# Altium schematic sheet Main.SchDoc
size A4; SheetNumber: 1; SheetTotal: 3
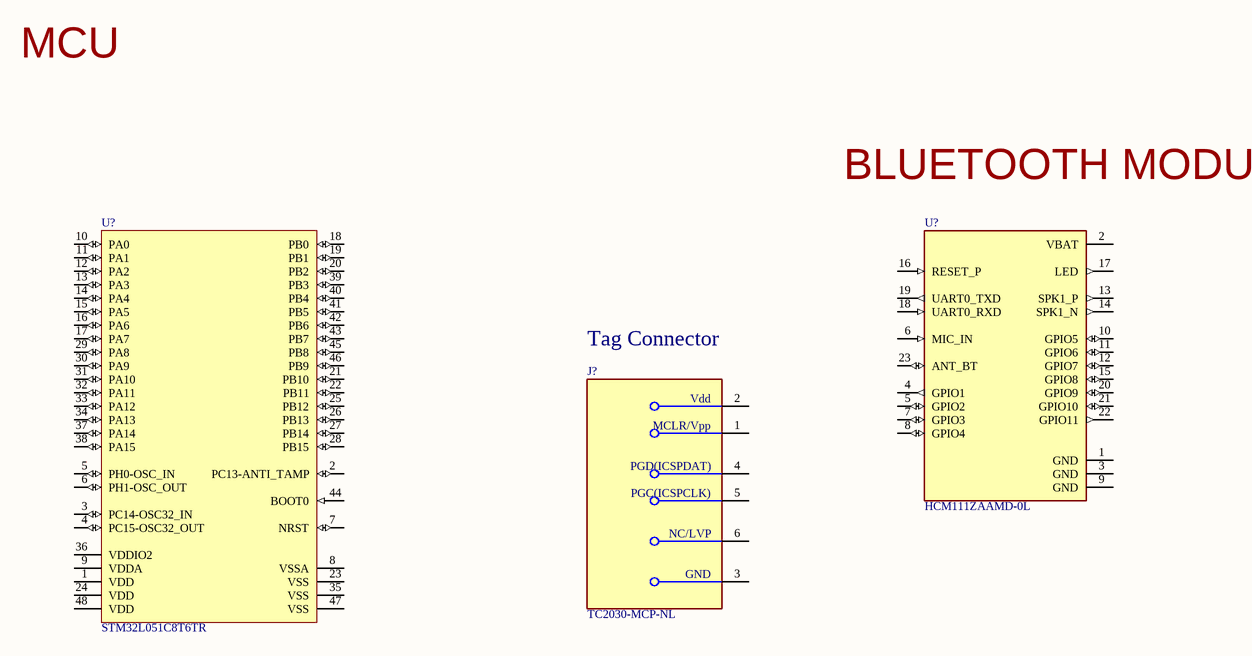
[diagram p0: Main.SchDoc]

## Parts
(Parts that share a designator on the sheet are numbered #1, #2 ... from top to bottom, then left to right.)
J?  TC2030-MCP-NL  [FP-TC2030-MCP-NL-MFG]
U?#1  STM32L051C8T6TR  [STM-LQFP48_N]
U?#2  HCM111ZAAMD-0L  [XCVR_HCM111ZAAMD-0L]

## Nets

Not connected (* = marked no-connect by the designer): J? 1(MCLR/Vpp) 2(Vdd) 3(GND) 4(PGD(ICSPDAT)) 5(PGC(ICSPCLK)) 6(NC/LVP); U?#1 1(VDD) 2(PC13-ANTI_TAMP) 3(PC14-OSC32_IN) 4(PC15-OSC32_OUT) 5(PH0-OSC_IN) 6(PH1-OSC_OUT) 7(NRST) 8(VSSA) 9(VDDA) 10(PA0) 11(PA1) 12(PA2) 13(PA3) 14(PA4) 15(PA5) 16(PA6) 17(PA7) 18(PB0) 19(PB1) 20(PB2) 21(PB10) 22(PB11) 23(VSS) 24(VDD) 25(PB12) 26(PB13) 27(PB14) 28(PB15) 29(PA8) 30(PA9) 31(PA10) 32(PA11) 33(PA12) 34(PA13) 35(VSS) 36(VDDIO2) 37(PA14) 38(PA15) 39(PB3) 40(PB4) 41(PB5) 42(PB6) 43(PB7) 44(BOOT0) 45(PB8) 46(PB9) 47(VSS) 48(VDD); U?#2 1(GND) 2(VBAT) 3(GND) 4(GPIO1) 5(GPIO2) 6(MIC_IN) 7(GPIO3) 8(GPIO4) 9(GND) 10(GPIO5) 11(GPIO6) 12(GPIO7) 13(SPK1_P) 14(SPK1_N) 15(GPIO8) 16(RESET_P) 17(LED) 18(UART0_RXD) 19(UART0_TXD) 20(GPIO9) 21(GPIO10) 22(GPIO11) 23(ANT_BT)

## Notes on the sheet
- MCU
- BLUETOOTH MODULE
- Tag Connector

## Library data of the parts
J? = CMP-205963-000002-1: CABLE TAG-CONNECT IN-CIRCUIT; RoHS Compliant: Yes; Series: -; Reach SVHC Compliant: Yes; Package Quantity: 1; Lead Free: Lead Free
U?#1 = CMP-1546-00004-1: Ultra-Low-Power ARM Cortex-M0+ MCU, 64 KB Flash, 1.8 to 3.6 V, -40 to 85 degC, 48-Pin LQFP, RoHS, Tape and Reel; Flash: 64 KB; VDD Min: 1.8 V; RAM: 8 KB; Data EEPROM: 2 KB; VDD Max: 3.6 V; Temperature Max: 85 degC; PartNumber: STM32L051C8T6TR; ComponentLink1URL: http://www.st.com/web/en/home.html; ComponentLink1Description: Manufacturer URL; PackageDescription: 48-Pin Frame Chip Scale Package, Body 7 x 7 mm, Pitch 0.5 mm; ComponentLink3URL: http://www.st.com/st-web-ui/static/active/en/resource/technical/document/datasheet/DM00058181.pdf; Packing: Tape and Reel; Mounting Technology: Surface Mount; ComponentLink3Description: Package Specification; RoHS: TRUE; ComponentLink2Description: Datasheet; Temperature Min: -40 degC; DatasheetVersion: Rev. 4; ComponentLink2URL: http://www.st.com/st-web-ui/static/active/en/resource/technical/document/datasheet/DM00108219.pdf
U?#2 = HCM111ZAAMD-0L: Package: None; Price: None; Value: *; MP: HCM111ZAAMD-0L; Availability: Unavailable